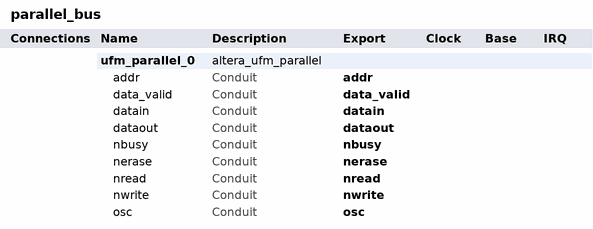
[diagram p0: system contents]
# Platform Designer (Qsys) system parallel_bus, MAX V 5M570ZF256C5
# Parameters at their usual value, and those the tool derives, are not listed.
package require -exact qsys 22.1
create_system parallel_bus
set_project_property DEVICE_FAMILY {MAX V}
set_project_property DEVICE 5M570ZF256C5

add_instance ufm_parallel_0 altera_ufm_parallel 22.1
set_instance_property ufm_parallel_0 AUTO_EXPORT true
set_instance_parameter_value ufm_parallel_0 ACCESS_MODE READ_WRITE
set_instance_parameter_value ufm_parallel_0 CBX_AUTO_BLACKBOX ALL
set_instance_parameter_value ufm_parallel_0 GUI_ERASE_TIME 500000
set_instance_parameter_value ufm_parallel_0 GUI_MEM_INIT {Initialize blank memory}
set_instance_parameter_value ufm_parallel_0 GUI_OSC_FREQUENCY 5.56
set_instance_parameter_value ufm_parallel_0 GUI_PROGRAM_TIME 1600
set_instance_parameter_value ufm_parallel_0 OSCENA_CHECK false
set_instance_parameter_value ufm_parallel_0 OSC_CHECK true
set_instance_parameter_value ufm_parallel_0 WIDTH_ADDRESS 8
set_instance_parameter_value ufm_parallel_0 WIDTH_DATA 8
set_instance_parameter_value ufm_parallel_0 WIDTH_UFM_ADDRESS 9

# exported interfaces
add_interface addr conduit end
set_interface_property addr EXPORT_OF ufm_parallel_0.addr
add_interface data_valid conduit end
set_interface_property data_valid EXPORT_OF ufm_parallel_0.data_valid
add_interface datain conduit end
set_interface_property datain EXPORT_OF ufm_parallel_0.datain
add_interface dataout conduit end
set_interface_property dataout EXPORT_OF ufm_parallel_0.dataout
add_interface nbusy conduit end
set_interface_property nbusy EXPORT_OF ufm_parallel_0.nbusy
add_interface nerase conduit end
set_interface_property nerase EXPORT_OF ufm_parallel_0.nerase
add_interface nread conduit end
set_interface_property nread EXPORT_OF ufm_parallel_0.nread
add_interface nwrite conduit end
set_interface_property nwrite EXPORT_OF ufm_parallel_0.nwrite
add_interface osc conduit end
set_interface_property osc EXPORT_OF ufm_parallel_0.osc

set_interconnect_requirement {$system} qsys_mm.clockCrossingAdapter HANDSHAKE
set_interconnect_requirement {$system} qsys_mm.enableEccProtection FALSE
set_interconnect_requirement {$system} qsys_mm.insertDefaultSlave FALSE
set_interconnect_requirement {$system} qsys_mm.maxAdditionalLatency 1

save_system parallel_bus.qsys
